# EAGLE design RPiEvm3 (EAGLE 9.6.2)
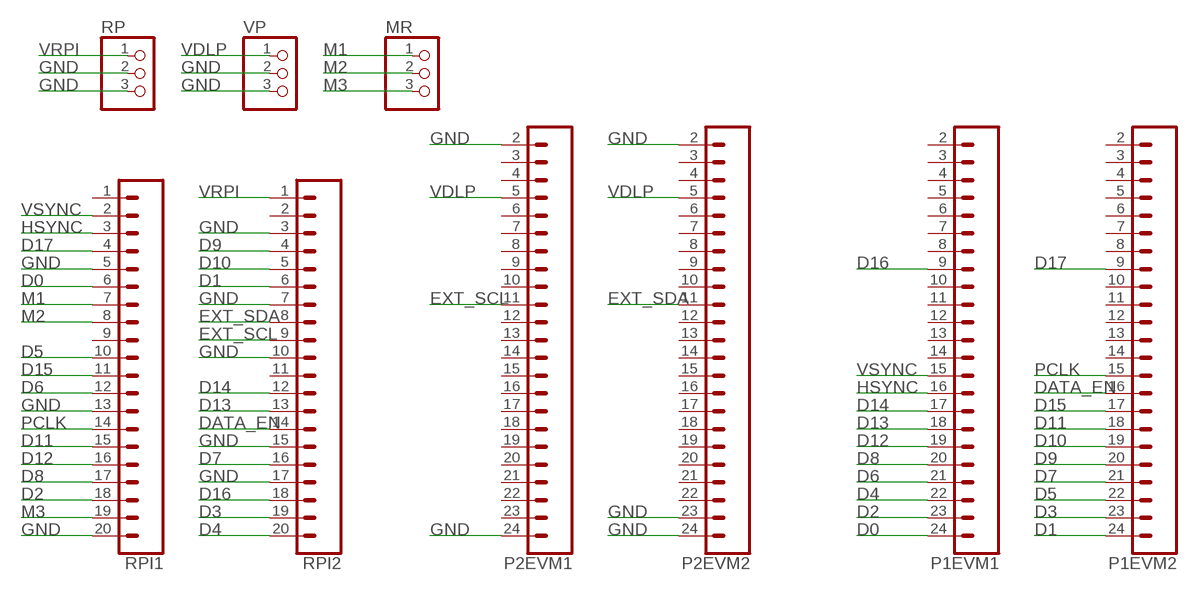
[diagram p0: schematic, sheet 1]

## Parts
MR  PINHD-1X3  [1X03]
P1EVM1  CONN_23  [1X23]
P1EVM2  CONN_23  [1X23]
P2EVM1  CONN_23  [1X23]
P2EVM2  CONN_23  [1X23]
RP  PINHD-1X3  [1X03]
RPI1  CONN_20  [1X20]
RPI2  CONN_20  [1X20]
VP  PINHD-1X3  [1X03]

## Nets
D0: P1EVM1.24 RPI1.6
D1: P1EVM2.24 RPI2.6
D2: P1EVM1.23 RPI1.18
D3: P1EVM2.23 RPI2.19
D4: P1EVM1.22 RPI2.20
D5: P1EVM2.22 RPI1.10
D6: P1EVM1.21 RPI1.12
D7: P1EVM2.21 RPI2.16
D8: P1EVM1.20 RPI1.17
D9: P1EVM2.20 RPI2.4
D10: P1EVM2.19 RPI2.5
D11: P1EVM2.18 RPI1.15
D12: P1EVM1.19 RPI1.16
D13: P1EVM1.18 RPI2.13
D14: P1EVM1.17 RPI2.12
D15: P1EVM2.17 RPI1.11
D16: P1EVM1.9 RPI2.18
D17: P1EVM2.9 RPI1.4
DATA_EN: P1EVM2.16 RPI2.14
EXT_SCL: P2EVM1.11 RPI2.9
EXT_SDA: P2EVM2.11 RPI2.8
GND: P2EVM1.2 P2EVM1.24 P2EVM2.2 P2EVM2.23 P2EVM2.24 RP.2 RP.3 RPI1.5 RPI1.13 RPI1.20 RPI2.3 RPI2.7 RPI2.10 RPI2.15 RPI2.17 VP.2 VP.3
HSYNC: P1EVM1.16 RPI1.3
M1: MR.1 RPI1.7
M2: MR.2 RPI1.8
M3: MR.3 RPI1.19
PCLK: P1EVM2.15 RPI1.14
VDLP: P2EVM1.5 P2EVM2.5 VP.1
VRPI: RP.1 RPI2.1
VSYNC: P1EVM1.15 RPI1.2
Unconnected: P1EVM1.2 P1EVM1.3 P1EVM1.4 P1EVM1.5 P1EVM1.6 P1EVM1.7 P1EVM1.8 P1EVM1.10 P1EVM1.11 P1EVM1.12 P1EVM1.13 P1EVM1.14 P1EVM2.2 P1EVM2.3 P1EVM2.4 P1EVM2.5 P1EVM2.6 P1EVM2.7 P1EVM2.8 P1EVM2.10 P1EVM2.11 P1EVM2.12 P1EVM2.13 P1EVM2.14 P2EVM1.3 P2EVM1.4 P2EVM1.6 P2EVM1.7 P2EVM1.8 P2EVM1.9 P2EVM1.10 P2EVM1.12 P2EVM1.13 P2EVM1.14 P2EVM1.15 P2EVM1.16 P2EVM1.17 P2EVM1.18 P2EVM1.19 P2EVM1.20 P2EVM1.21 P2EVM1.22 P2EVM1.23 P2EVM2.3 P2EVM2.4 P2EVM2.6 P2EVM2.7 P2EVM2.8 P2EVM2.9 P2EVM2.10 P2EVM2.12 P2EVM2.13 P2EVM2.14 P2EVM2.15 P2EVM2.16 P2EVM2.17 P2EVM2.18 P2EVM2.19 P2EVM2.20 P2EVM2.21 P2EVM2.22 RPI1.1 RPI1.9 RPI2.2 RPI2.11

## Library data of the parts
MR RP VP = adafruit:PINHD-1X3: PIN HEADER
P1EVM1 P1EVM2 P2EVM1 P2EVM2 = SparkFun-Connectors:CONN_23: Multi connection point. Often used as Generic Header-pin footprint for 0.1 inch spaced/style header connections On any of the 0.1 inch spaced packages, you can populate with these: Break Away Headers - Straight <https://www.sparkfun.com/products/116> (PRT-00116) Break Away Male Headers - Right Angle <https://www.sparkfun.com/products/553> (PRT-00553) Female Headers <https://www.sparkfun.com/products/115> (PRT-00115) Break Away Headers - Machine Pin <https://www.sparkfun.com/products/117> (PRT-00117) Break Away Female Headers - Swiss Machine Pin <https://www.sparkfun.com/products/743> (PRT-00743) For SCREWTERMINALS and SPRING TERMINALS visit here: Screw Terimnals on SparkFun.com <https://www.sparkfun.com/search/results?term=Screw+Terminals> (5mm/3.5mm/2.54mm spacing) This device is also useful as a general connection point to wire up your design to another part of your project. Our various solder wires solder well into these plated through hole pads. Hook-Up Wire - Assortment (Stranded, 22 AWG) <https://www.sparkfun.com/products/11375> (PRT-11375) Hook-Up Wire - Assortment (Solid Core, 22 AWG) <https://www.sparkfun.com/products/11367> (PRT-11367) View the entire wire category on our website here <https://www.sparkfun.com/categories/141> Special notes: Molex polarized connector foot print use with SKU : PRT-08231 with associated crimp pins and housings. 1MM SMD Version SKU: PRT-10208 NOTES ON THE VARIANTS LOCK and LOCK_LONGPADS... This footprint was designed to help hold the alignment of a through-hole component (i.e. 6-pin header) while soldering it into place. You may notice that each hole has been shifted either up or down by 0.005 of an inch from it's more standard position (which is a perfectly straight line). This slight alteration caused the pins (the squares in the middle) to touch the edges of the holes. Because they are alternating, it causes a "brace" to hold the component in place. 0.005 has proven to be the perfect amount of "off-center" position when using our standard breakaway headers. Although looks a little odd when you look at the bare footprint, once you have a header in there, the alteration is very hard to notice. Also,if you push a header all the way into place, it is covered up entirely on the bottom side.
RPI1 RPI2 = SparkFun-Connectors:CONN_20: Multi connection point. Often used as Generic Header-pin footprint for 0.1 inch spaced/style header connections On any of the 0.1 inch spaced packages, you can populate with these: Break Away Headers - Straight <https://www.sparkfun.com/products/116> (PRT-00116) Break Away Male Headers - Right Angle <https://www.sparkfun.com/products/553> (PRT-00553) Female Headers <https://www.sparkfun.com/products/115> (PRT-00115) Break Away Headers - Machine Pin <https://www.sparkfun.com/products/117> (PRT-00117) Break Away Female Headers - Swiss Machine Pin <https://www.sparkfun.com/products/743> (PRT-00743) For SCREWTERMINALS and SPRING TERMINALS visit here: Screw Terimnals on SparkFun.com <https://www.sparkfun.com/search/results?term=Screw+Terminals> (5mm/3.5mm/2.54mm spacing) This device is also useful as a general connection point to wire up your design to another part of your project. Our various solder wires solder well into these plated through hole pads. Hook-Up Wire - Assortment (Stranded, 22 AWG) <https://www.sparkfun.com/products/11375> (PRT-11375) Hook-Up Wire - Assortment (Solid Core, 22 AWG) <https://www.sparkfun.com/products/11367> (PRT-11367) View the entire wire category on our website here <https://www.sparkfun.com/categories/141> Special notes: Molex polarized connector foot print use with SKU : PRT-08231 with associated crimp pins and housings. 1MM SMD Version SKU: PRT-10208 NOTES ON THE VARIANTS LOCK and LOCK_LONGPADS... This footprint was designed to help hold the alignment of a through-hole component (i.e. 6-pin header) while soldering it into place. You may notice that each hole has been shifted either up or down by 0.005 of an inch from it's more standard position (which is a perfectly straight line). This slight alteration caused the pins (the squares in the middle) to touch the edges of the holes. Because they are alternating, it causes a "brace" to hold the component in place. 0.005 has proven to be the perfect amount of "off-center" position when using our standard breakaway headers. Although looks a little odd when you look at the bare footprint, once you have a header in there, the alteration is very hard to notice. Also,if you push a header all the way into place, it is covered up entirely on the bottom side. Note about LOCK SPECIAL package: This is just like the LOCK variant in that the holes are staggared by 5 mil, but except for the last two holes. They are not altered from the "standard" footprint layout. This is used for a special purpose on the layout of our Graphic LCD Backpack. Make sure you want to use this device before selecting it for you project!

## Board
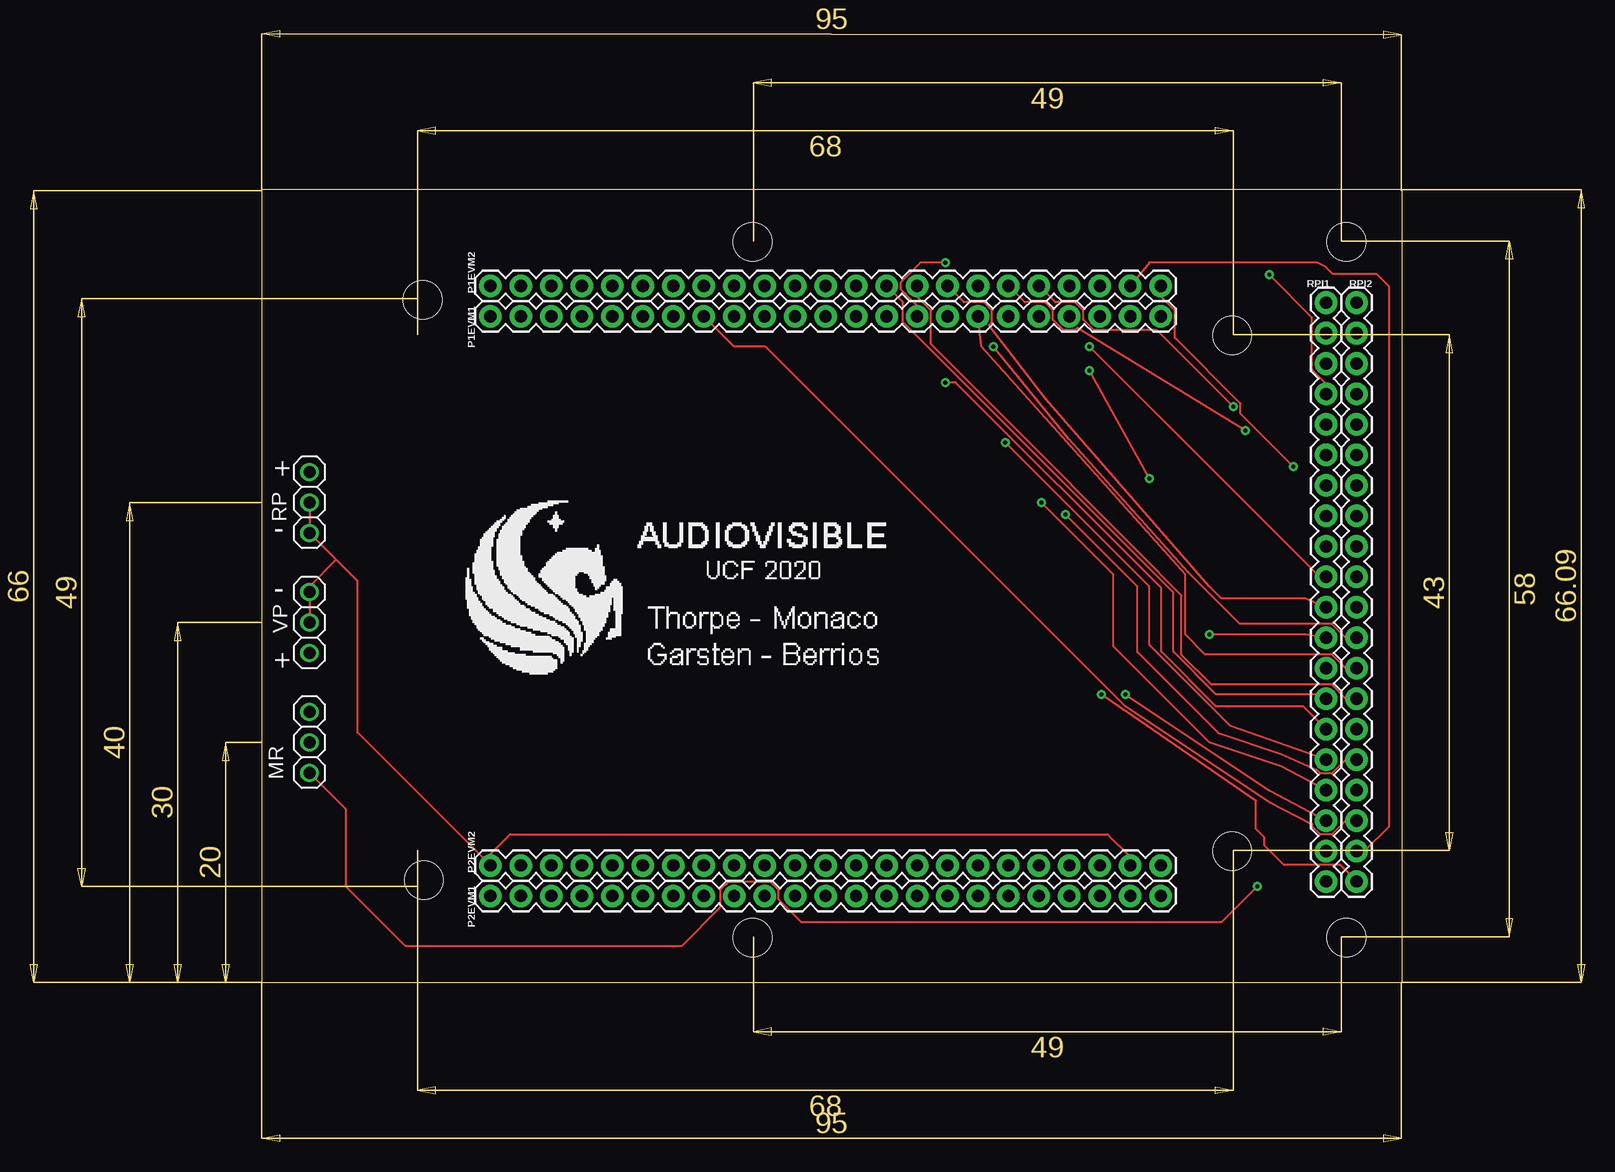
[diagram p1: board, top side]
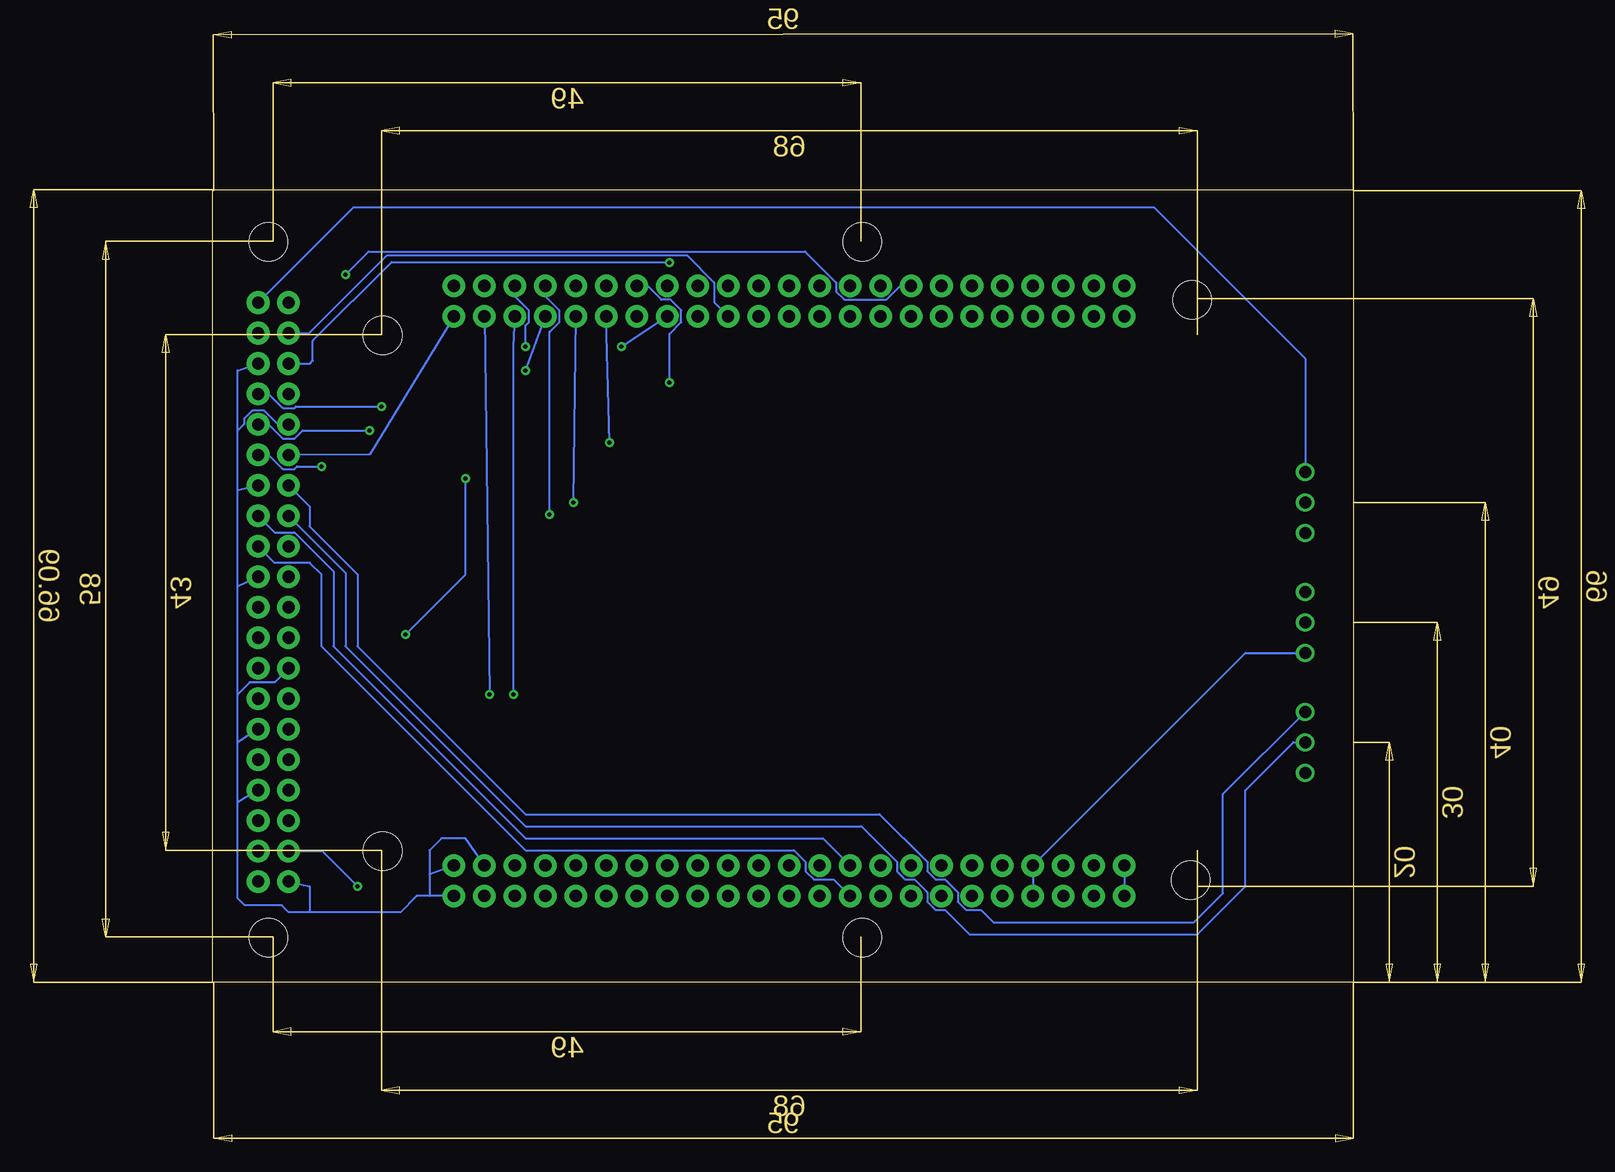
[diagram p2: board, bottom side, seen from below]

Size 95.09 x 66.09 mm. Coordinates in mm from the lower left corner, seen from the top.
Outline: 0,0 95.09,0 95.09,66.09 0,66.09 0,0
Copper layers (1*16): Top 0.035mm / dielectric 1.5mm / Bottom 0.035mm
Design rules "default": minimum track width 6mil, minimum drill 0.35mm, track to track 6mil, track to pad 6mil, pad to pad 6mil, via to via 6mil, smd to smd 6mil, copper to edge 40mil, drill to drill 6mil, minimum pad ring 10mil, minimum via ring 8mil, stop-mask expansion 4mil, vias tented up to drill 0mil, thermal gap 10mil

### Footprints (pad centres in the part's own frame; a part is rotated, then mirrored left to right if it is on the bottom)
1X03 = drill 1.016: 1 -2.54,0; 2 0,0; 3 2.54,0
1X23 = drill 1.016 pad 1.88: 2 -26.67,0; 3 -24.13,0; 4 -21.59,0; 5 -19.05,0; 6 -16.51,0; 7 -13.97,0; 8 -11.43,0; 9 -8.89,0; 10 -6.35,0; 11 -3.81,0; 12 -1.27,0; 13 1.27,0; 14 3.81,0; 15 6.35,0; 16 8.89,0; 17 11.43,0; 18 13.97,0; 19 16.51,0; 20 19.05,0; 21 21.59,0; 22 24.13,0; 23 26.67,0; 24 29.21,0
1X20 = drill 1.016 pad 1.88: 1 0,0; 2 2.54,0; 3 5.08,0; 4 7.62,0; 5 10.16,0; 6 12.7,0; 7 15.24,0; 8 17.78,0; 9 20.32,0; 10 22.86,0; 11 25.4,0; 12 27.94,0; 13 30.48,0; 14 33.02,0; 15 35.56,0; 16 38.1,0; 17 40.64,0; 18 43.18,0; 19 45.72,0; 20 48.26,0
3_2_HOLE = hole 3.2: -1.57,1.73

### Placement (x,y rotation side)
MR  4,20 270 top
P1EVM1  45.75,55.52 0 top
P1EVM2  45.75,58.06 0 top
P2EVM1  45.75,7.2 0 top
P2EVM2  45.75,9.74 0 top
RP  4,40 270 top
RPI1  88.74,56.66 270 top
RPI2  91.28,56.66 270 top
U$1  [3_2_HOLE]  92,2 0 top
U$2  [3_2_HOLE]  92,60 0 top
U$3  [3_2_HOLE]  15,55.15 0 top
U$4  [3_2_HOLE]  15.11,6.8 0 top
U$5  [3_2_HOLE]  82.47,52.22 0 top
U$6  [3_2_HOLE]  82.47,9.22 0 top
U$7  [3_2_HOLE]  42.5,60 0 top
U$8  [3_2_HOLE]  42.5,2 0 top
VP  4,30 90 top

### Tracks (layer width: path | path; a pad name or v marks a point on that pad's centre or on a via)
D0
  Bottom 0.152: P1EVM1.24 82,44 RPI1.6
D1  (via drill 0.35)
  Top 0.152: P1EVM2.24 74.96,57.17 76.13,56 76.13,53.73 81.61,48.25 81.61,47.39 v86,43
  Bottom 0.152: RPI2.6 90.39,43.96 89.22,42.79 88.26,42.79 88.05,43 v86,43
D2  (via drill 0.35)
  Top 0.152: v72,24 84,16 RPI1.18
  Bottom 0.152: P1EVM1.23 v72,24
D3
  Top 0.152: RPI2.19 91.94,10.94 94,13 94,58 92.96,59.04 89.31,59.04 88.68,59.68 88,60 74,60 P1EVM2.23
D4  (via drill 0.35)
  Top 0.152: RPI2.20 89.91,9.77 85.23,9.77 83.6,11.4 83.6,12.06 82.89,12.77 82.89,15.14 71.9,22.7 71.87,22.7 71.82,22.75 v70,24
  Bottom 0.152: P1EVM1.22 70,53 v70,24
D5  (via drill 0.35)
  Top 0.152: RPI1.10 88.54,34 88,34 v69,53
  Bottom 0.152: v69,53 69,54.75 68.71,55.04 68.71,56 69.88,57.17 P1EVM2.22
D6  (via drill 0.35)
  Top 0.152: RPI1.12 87,29 v79,29 | v74,42 v69,51
  Bottom 0.152: v69,51 P1EVM1.21 | v79,29 74,34 v74,42
D7  (via drill 0.35)
  Top 0.152: RPI2.16 90.39,18.56 89.22,17.39 88.26,17.39 88,17.65 85,19 79.8,20.73 73,27.53 73,33 v67,39
  Bottom 0.152: v67,39 67,54.21 66.17,55.04 66.17,56 67.34,57.17 P1EVM2.21
D8  (via drill 0.35)
  Top 0.152: RPI1.17 85,18 79,20 71,28 71,34 v65,40
  Bottom 0.152: v65,40 P1EVM1.20
D9  (via drill 0.35)
  Top 0.152: v81,48 74.65,54.35 69.4,54.35 68.51,55.24 68.51,56 67.82,56.69 66.17,56.69 P1EVM2.20
  Bottom 0.152: RPI2.4 90.39,49.04 89.22,47.87 88.26,47.87 88.13,48 v81,48
D10  (via drill 0.35)
  Top 0.152: v82,46 68.02,54.54 67.82,54.35 66.86,54.35 65.97,55.24 65.97,56 65.28,56.69 63.63,56.69 P1EVM2.19
  Bottom 0.152: RPI2.5 90.39,46.5 89.22,45.33 88.26,45.33 87.59,46 v82,46
D11  (via drill 0.35)
  Top 0.152: RPI1.15 86.84,23 79.57,23 75,27.57 75,32.86 57.86,50 v57,50
  Bottom 0.152: P1EVM2.18 58.83,58.06 57.66,56.89 56.9,56.89 56.01,56 56,56 56.01,55.99 56.01,55.04 57,54.05 v57,50
D12  (via drill 0.35)
  Top 0.152: v62,45 74,33 74,28.14 80.76,21.38 RPI1.16
  Bottom 0.152: v62,45 P1EVM1.19
D13
  Top 0.152: RPI2.13 90.39,26.18 89.22,27.35 78.65,27.35 77,29 77,34 60,53 P1EVM1.18
D14  (via drill 0.35)
  Top 0.152: RPI2.12 90.39,28.72 89.22,29.89 81.54,29.89 77.22,34.21 67.32,45.28 v61,53
  Bottom 0.152: v61,53 P1EVM1.17
D15
  Top 0.152: RPI1.11 87,32 80,32 79,33 65.39,48.63 60.66,54.8 60.89,55.04 60.89,56 60.2,56.69 58.55,56.69 P1EVM2.17
D16
  Top 0.152: RPI2.18 90.39,13.48 89.22,12.31 88.26,12.31 87.57,13 87.57,13.16 84,15 72,23 42,53 39.38,53 P1EVM1.9
D17  (via drill 0.35)
  Top 0.152: RPI1.4 88.74,49.93 87.57,51.1 87.57,55.43 v84,59
  Bottom 0.152: P1EVM2.9 37.75,58.06 38.92,56.89 42.42,56.89 43.11,57.58 43.11,58.34 45.68,60.91 82.09,60.91 v84,59
DATA_EN
  Top 0.152: RPI2.14 90.39,23.64 89.22,24.81 79.19,24.81 76.69,27.3 76.69,32.24 73,35.94 62,47 55.81,53.19 55.81,56 54.64,57.17 P1EVM2.16
EXT_SCL
  Bottom 0.152: RPI2.9 89.91,34.97 86.97,34.97 86,34 86,28 69,11 46.63,11 45.65,10.02 45.65,9.26 44.96,8.57 43.31,8.57 P2EVM1.11
EXT_SDA
  Bottom 0.152: RPI2.8 89.91,37.51 88.26,37.51 85,34.25 85,28 69,12 44.2,12 P2EVM2.11
GND
  Top 0.152: P2EVM2.23 72.42,10.44 70.52,12.34 20.73,12.34 19.08,10.69 P2EVM2.2 8,20.82 8,33.46 6.23,35.23 | RP.2 RP.3 6.23,35.23 | VP.2 VP.3 4,33 6.23,35.23
  Bottom 0.152: P2EVM1.24 77,7.2 | 77,7.2 78.05,7.2 79.42,5.84 87,5.84 | 87,5.84 88.73,5.84 89.31,6.42 92.42,6.42 93,7 93,15 | 93,15 93,20 | 93,20 93,24 | 93,24 93,33 | 93,33 93,41 | 93,41 93,46 | 93,46 93,51 RPI2.3 | RPI2.7 93,41 | RPI2.10 93,33 | RPI2.15 93,20 | RPI2.17 93,15 | 87,5.84 87,8 RPI1.20 | P2EVM2.23 74,12 76,12 77,11 77,9 | 77,9 77,7.2 | P2EVM2.24 77,9 | 93,46 92.45,46.55 92.45,46.98 91.76,47.67 90.8,47.67 89.63,46.5 RPI1.5 | P2EVM2.2 P2EVM1.2 | RPI1.13 89.92,25 92,25 93,24
HSYNC  (via drill 0.35)
  Top 0.152: P1EVM1.16 54.64,56.41 53.27,57.78 53.27,58.34 54.93,60 v57,60
  Bottom 0.152: v57,60 57.15,60 57.2,60.05 80.17,60.05 86.72,53.49 86.72,51.82 86.96,51.58 RPI1.3
M1
  Bottom 0.152: RPI1.7 87,39.68 87,38 83,34 83,28 69,14 39.47,14 35.49,10.02 35.49,9.26 34.8,8.57 34.04,8.57 32.95,7.48 32.95,6.72 32.26,6.03 31.03,6.03 30,5 13.26,5 10.85,7.42 10.85,15.69 MR.1
M2
  Bottom 0.152: RPI1.8 84,34.14 84,28 69,13 41,13 38.03,10.03 38.03,9.26 37.34,8.57 36.58,8.57 35.49,7.48 35.49,6.72 34.8,6.03 34.03,6.03 32,4 13,4 9,8 9,16 5,20 MR.2
M3  (via drill 0.35)
  Top 0.152: v83,8 80,5 45.03,5 43.11,6.92 43.11,7.68 42.42,8.37 38.92,8.37 38.23,7.68 38.23,6.23 35,3 12,3 7,8 7,14.46 MR.3
  Bottom 0.152: RPI1.19 85.94,10.94 v83,8
PCLK
  Top 0.152: P1EVM2.15 53.47,56.69 53.47,55.04 76,32.51 76,27.57 79.57,24 88.38,24 RPI1.14
VDLP
  Bottom 0.152: VP.1 8.98,27.46 P2EVM2.5 P2EVM1.5
VRPI
  Bottom 0.152: RPI2.1 83.32,64.62 16.62,64.62 4,52 RP.1
VSYNC
  Bottom 0.152: P1EVM1.15 53.27,56.69 53.27,58.34 55.53,60.61 80.52,60.61 87.01,54.12 RPI1.2

### Text on the board
tPlace: + | - | - | +